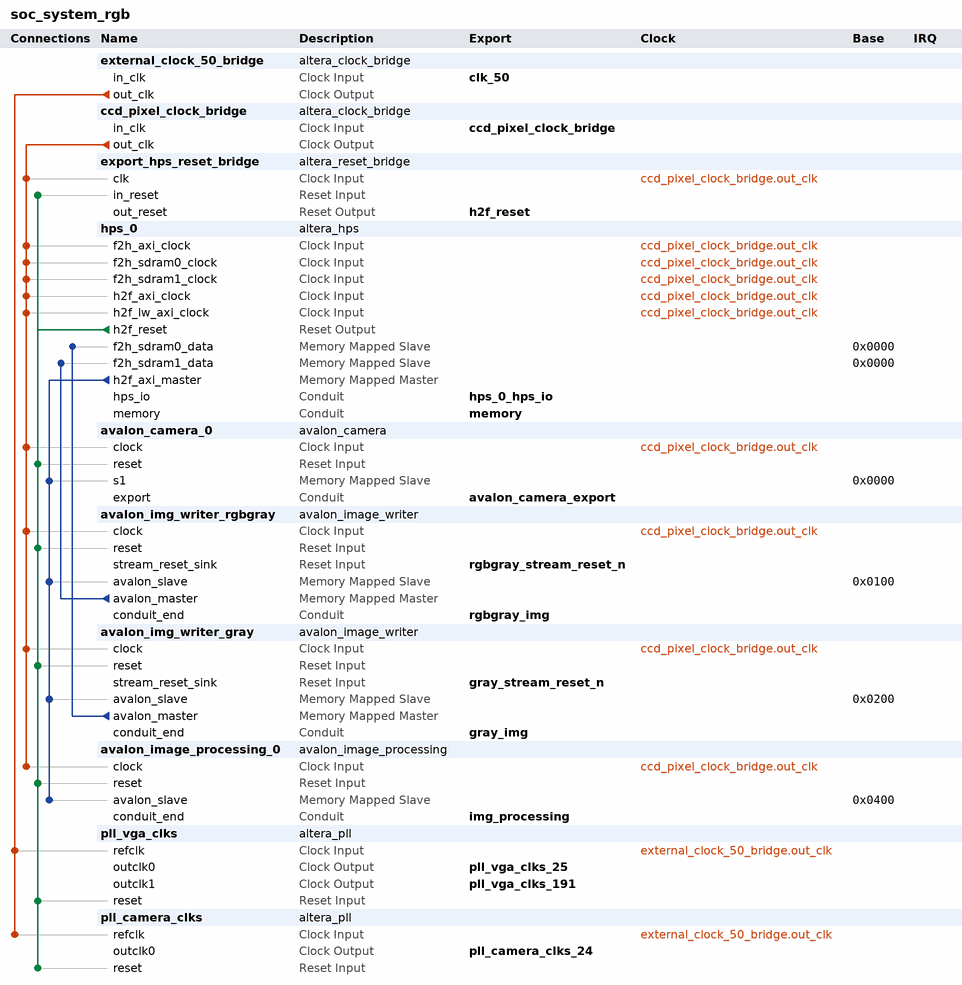
[diagram p0: system contents]
# Platform Designer (Qsys) system soc_system_rgb, Cyclone V 5CSEMA5F31C6
# Parameters at their usual value, and those the tool derives, are not listed.
package require -exact qsys 18.1
create_system soc_system_rgb
set_project_property DEVICE_FAMILY {Cyclone V}
set_project_property DEVICE 5CSEMA5F31C6

add_instance external_clock_50_bridge altera_clock_bridge 18.1
set_instance_parameter_value external_clock_50_bridge DERIVED_CLOCK_RATE 0
set_instance_parameter_value external_clock_50_bridge EXPLICIT_CLOCK_RATE 50000000

add_instance ccd_pixel_clock_bridge altera_clock_bridge 18.1
set_instance_parameter_value ccd_pixel_clock_bridge DERIVED_CLOCK_RATE 0
set_instance_parameter_value ccd_pixel_clock_bridge EXPLICIT_CLOCK_RATE 0

add_instance export_hps_reset_bridge altera_reset_bridge 18.1
set_instance_parameter_value export_hps_reset_bridge ACTIVE_LOW_RESET 1
set_instance_parameter_value export_hps_reset_bridge SYNCHRONOUS_EDGES deassert

add_instance hps_0 altera_hps 18.1
set_instance_parameter_value hps_0 EMAC1_Mode RGMII
set_instance_parameter_value hps_0 EMAC1_PinMuxing {HPS I/O Set 0}
set_instance_parameter_value hps_0 F2SCLK_COLDRST_Enable false
set_instance_parameter_value hps_0 F2SCLK_DBGRST_Enable false
set_instance_parameter_value hps_0 F2SCLK_WARMRST_Enable false
set_instance_parameter_value hps_0 F2SDRAM_Type {Avalon-MM Write-Only,Avalon-MM Write-Only}
set_instance_parameter_value hps_0 F2SDRAM_Width 128,128
set_instance_parameter_value hps_0 F2SINTERRUPT_Enable true
set_instance_parameter_value hps_0 F2S_Width 3
set_instance_parameter_value hps_0 FPGA_PERIPHERAL_OUTPUT_CLOCK_FREQ_EMAC0_GTX_CLK 100
set_instance_parameter_value hps_0 FPGA_PERIPHERAL_OUTPUT_CLOCK_FREQ_EMAC0_MD_CLK 100.0
set_instance_parameter_value hps_0 FPGA_PERIPHERAL_OUTPUT_CLOCK_FREQ_EMAC1_GTX_CLK 100
set_instance_parameter_value hps_0 FPGA_PERIPHERAL_OUTPUT_CLOCK_FREQ_EMAC1_MD_CLK 100.0
set_instance_parameter_value hps_0 HPS_PROTOCOL DDR3
set_instance_parameter_value hps_0 I2C0_Mode I2C
set_instance_parameter_value hps_0 I2C0_PinMuxing {HPS I/O Set 0}
set_instance_parameter_value hps_0 I2C1_Mode N/A
set_instance_parameter_value hps_0 I2C1_PinMuxing Unused
set_instance_parameter_value hps_0 LWH2F_Enable true
set_instance_parameter_value hps_0 MEM_BANKADDR_WIDTH 3
set_instance_parameter_value hps_0 MEM_CLK_FREQ 400.0
set_instance_parameter_value hps_0 MEM_COL_ADDR_WIDTH 10
set_instance_parameter_value hps_0 MEM_DQ_WIDTH 32
set_instance_parameter_value hps_0 MEM_DRV_STR RZQ/7
set_instance_parameter_value hps_0 MEM_ROW_ADDR_WIDTH 15
set_instance_parameter_value hps_0 MEM_RTT_NOM RZQ/4
set_instance_parameter_value hps_0 MEM_RTT_WR RZQ/4
set_instance_parameter_value hps_0 MEM_TCL 11
set_instance_parameter_value hps_0 MEM_TFAW_NS 30.0
set_instance_parameter_value hps_0 MEM_TRAS_NS 35.0
set_instance_parameter_value hps_0 MEM_TRCD_NS 13.75
set_instance_parameter_value hps_0 MEM_TRFC_NS 260.0
set_instance_parameter_value hps_0 MEM_TRP_NS 13.75
set_instance_parameter_value hps_0 MEM_VENDOR Micron
set_instance_parameter_value hps_0 MEM_WTCL 8
set_instance_parameter_value hps_0 QSPI_Mode N/A
set_instance_parameter_value hps_0 QSPI_PinMuxing Unused
set_instance_parameter_value hps_0 REF_CLK_FREQ 25.0
set_instance_parameter_value hps_0 S2FCLK_USER2CLK 5
set_instance_parameter_value hps_0 S2F_Width 3
set_instance_parameter_value hps_0 SDIO_Mode {4-bit Data}
set_instance_parameter_value hps_0 SDIO_PinMuxing {HPS I/O Set 0}
set_instance_parameter_value hps_0 SPIM1_Mode N/A
set_instance_parameter_value hps_0 SPIM1_PinMuxing Unused
set_instance_parameter_value hps_0 STM_Enable false
set_instance_parameter_value hps_0 TIMING_BOARD_AC_SKEW 0.02
set_instance_parameter_value hps_0 TIMING_BOARD_AC_TO_CK_SKEW 0.01
set_instance_parameter_value hps_0 TIMING_BOARD_DQ_TO_DQS_SKEW 0.05
set_instance_parameter_value hps_0 TIMING_BOARD_MAX_CK_DELAY 0.03
set_instance_parameter_value hps_0 TIMING_BOARD_MAX_DQS_DELAY 0.02
set_instance_parameter_value hps_0 TIMING_BOARD_SKEW_BETWEEN_DQS 0.06
set_instance_parameter_value hps_0 TIMING_BOARD_SKEW_CKDQS_DIMM_MAX 0.12
set_instance_parameter_value hps_0 TIMING_BOARD_SKEW_CKDQS_DIMM_MIN 0.06
set_instance_parameter_value hps_0 TIMING_BOARD_SKEW_WITHIN_DQS 0.01
set_instance_parameter_value hps_0 TIMING_TDH 65
set_instance_parameter_value hps_0 TIMING_TDQSCK 255
set_instance_parameter_value hps_0 TIMING_TDQSQ 125
set_instance_parameter_value hps_0 TIMING_TDS 30
set_instance_parameter_value hps_0 TIMING_TIH 140
set_instance_parameter_value hps_0 TIMING_TIS 180
set_instance_parameter_value hps_0 TIMING_TQSH 0.4
set_instance_parameter_value hps_0 UART0_Mode {No Flow Control}
set_instance_parameter_value hps_0 UART0_PinMuxing {HPS I/O Set 0}
set_instance_parameter_value hps_0 USB1_Mode SDR
set_instance_parameter_value hps_0 USB1_PinMuxing {HPS I/O Set 0}
set_instance_parameter_value hps_0 desired_cfg_clk_mhz 100.0
set_instance_parameter_value hps_0 desired_qspi_clk_mhz 400.0

add_instance avalon_camera_0 avalon_camera 1.0
set_instance_parameter_value avalon_camera_0 BLUE_GAIN 154
set_instance_parameter_value avalon_camera_0 COLUMN_MODE 3
set_instance_parameter_value avalon_camera_0 COLUMN_SIZE 2559
set_instance_parameter_value avalon_camera_0 EXPOSURE 1023
set_instance_parameter_value avalon_camera_0 GREEN1_GAIN 19
set_instance_parameter_value avalon_camera_0 GREEN2_GAIN 19
set_instance_parameter_value avalon_camera_0 HEIGHT 480
set_instance_parameter_value avalon_camera_0 H_BLANKING 0
set_instance_parameter_value avalon_camera_0 RED_GAIN 156
set_instance_parameter_value avalon_camera_0 ROW_MODE 3
set_instance_parameter_value avalon_camera_0 ROW_SIZE 1919
set_instance_parameter_value avalon_camera_0 START_COLUMN 0
set_instance_parameter_value avalon_camera_0 START_ROW 0
set_instance_parameter_value avalon_camera_0 V_BLANKING 25
set_instance_parameter_value avalon_camera_0 WIDTH 640

add_instance avalon_img_writer_rgbgray avalon_image_writer 1.0
set_instance_parameter_value avalon_img_writer_rgbgray COMPONENT_SIZE 8
set_instance_parameter_value avalon_img_writer_rgbgray NUMBER_COMPONENTS 4
set_instance_parameter_value avalon_img_writer_rgbgray PIX_WR 4

add_instance avalon_img_writer_gray avalon_image_writer 1.0
set_instance_parameter_value avalon_img_writer_gray COMPONENT_SIZE 8
set_instance_parameter_value avalon_img_writer_gray NUMBER_COMPONENTS 1
set_instance_parameter_value avalon_img_writer_gray PIX_WR 16

add_instance avalon_image_processing_0 avalon_image_processing 1.0
set_instance_parameter_value avalon_image_processing_0 BRIGHTNESS_THRESHOLD_H 255
set_instance_parameter_value avalon_image_processing_0 BRIGHTNESS_THRESHOLD_L 45
set_instance_parameter_value avalon_image_processing_0 HUE_THRESHOLD_H 20
set_instance_parameter_value avalon_image_processing_0 HUE_THRESHOLD_L 230
set_instance_parameter_value avalon_image_processing_0 SATURATION_THRESHOLD_H 255
set_instance_parameter_value avalon_image_processing_0 SATURATION_THRESHOLD_L 20

add_instance pll_vga_clks altera_pll 18.1
set_instance_parameter_value pll_vga_clks gui_device_speed_grade 2
set_instance_parameter_value pll_vga_clks gui_number_of_clocks 2
set_instance_parameter_value pll_vga_clks gui_operation_mode direct
set_instance_parameter_value pll_vga_clks gui_output_clock_frequency0 25.175
set_instance_parameter_value pll_vga_clks gui_output_clock_frequency1 191.0
set_instance_parameter_value pll_vga_clks gui_pll_mode {Integer-N PLL}
set_instance_parameter_value pll_vga_clks gui_reference_clock_frequency 50.0
set_instance_parameter_value pll_vga_clks gui_use_locked false

add_instance pll_camera_clks altera_pll 18.1
set_instance_parameter_value pll_camera_clks gui_device_speed_grade 2
set_instance_parameter_value pll_camera_clks gui_number_of_clocks 1
set_instance_parameter_value pll_camera_clks gui_operation_mode direct
set_instance_parameter_value pll_camera_clks gui_output_clock_frequency0 24.0
set_instance_parameter_value pll_camera_clks gui_pll_mode {Integer-N PLL}
set_instance_parameter_value pll_camera_clks gui_reference_clock_frequency 50.0
set_instance_parameter_value pll_camera_clks gui_use_locked false

# connections
add_connection ccd_pixel_clock_bridge.out_clk avalon_camera_0.clock clock
add_connection ccd_pixel_clock_bridge.out_clk avalon_image_processing_0.clock clock
add_connection ccd_pixel_clock_bridge.out_clk avalon_img_writer_gray.clock clock
add_connection ccd_pixel_clock_bridge.out_clk avalon_img_writer_rgbgray.clock clock
add_connection ccd_pixel_clock_bridge.out_clk export_hps_reset_bridge.clk clock
add_connection ccd_pixel_clock_bridge.out_clk hps_0.f2h_axi_clock clock
add_connection ccd_pixel_clock_bridge.out_clk hps_0.f2h_sdram0_clock clock
add_connection ccd_pixel_clock_bridge.out_clk hps_0.f2h_sdram1_clock clock
add_connection ccd_pixel_clock_bridge.out_clk hps_0.h2f_axi_clock clock
add_connection ccd_pixel_clock_bridge.out_clk hps_0.h2f_lw_axi_clock clock
add_connection external_clock_50_bridge.out_clk pll_camera_clks.refclk clock
add_connection external_clock_50_bridge.out_clk pll_vga_clks.refclk clock
add_connection hps_0.h2f_reset avalon_camera_0.reset reset
add_connection hps_0.h2f_reset avalon_image_processing_0.reset reset
add_connection hps_0.h2f_reset avalon_img_writer_gray.reset reset
add_connection hps_0.h2f_reset avalon_img_writer_rgbgray.reset reset
add_connection hps_0.h2f_reset export_hps_reset_bridge.in_reset reset
add_connection hps_0.h2f_reset pll_camera_clks.reset reset
add_connection hps_0.h2f_reset pll_vga_clks.reset reset
add_connection avalon_img_writer_gray.avalon_master hps_0.f2h_sdram0_data avalon
set_connection_parameter_value avalon_img_writer_gray.avalon_master/hps_0.f2h_sdram0_data baseAddress 0x0000
add_connection avalon_img_writer_rgbgray.avalon_master hps_0.f2h_sdram1_data avalon
set_connection_parameter_value avalon_img_writer_rgbgray.avalon_master/hps_0.f2h_sdram1_data baseAddress 0x0000
add_connection hps_0.h2f_axi_master avalon_camera_0.s1 avalon
set_connection_parameter_value hps_0.h2f_axi_master/avalon_camera_0.s1 baseAddress 0x0000
add_connection hps_0.h2f_axi_master avalon_image_processing_0.avalon_slave avalon
set_connection_parameter_value hps_0.h2f_axi_master/avalon_image_processing_0.avalon_slave baseAddress 0x0400
add_connection hps_0.h2f_axi_master avalon_img_writer_gray.avalon_slave avalon
set_connection_parameter_value hps_0.h2f_axi_master/avalon_img_writer_gray.avalon_slave baseAddress 0x0200
add_connection hps_0.h2f_axi_master avalon_img_writer_rgbgray.avalon_slave avalon
set_connection_parameter_value hps_0.h2f_axi_master/avalon_img_writer_rgbgray.avalon_slave baseAddress 0x0100

# exported interfaces
add_interface avalon_camera_export conduit end
set_interface_property avalon_camera_export EXPORT_OF avalon_camera_0.export
add_interface ccd_pixel_clock_bridge clock sink
set_interface_property ccd_pixel_clock_bridge EXPORT_OF ccd_pixel_clock_bridge.in_clk
add_interface clk_50 clock sink
set_interface_property clk_50 EXPORT_OF external_clock_50_bridge.in_clk
add_interface gray_img conduit end
set_interface_property gray_img EXPORT_OF avalon_img_writer_gray.conduit_end
add_interface gray_stream_reset_n reset sink
set_interface_property gray_stream_reset_n EXPORT_OF avalon_img_writer_gray.stream_reset_sink
add_interface h2f_reset reset source
set_interface_property h2f_reset EXPORT_OF export_hps_reset_bridge.out_reset
add_interface hps_0_hps_io conduit end
set_interface_property hps_0_hps_io EXPORT_OF hps_0.hps_io
add_interface img_processing conduit end
set_interface_property img_processing EXPORT_OF avalon_image_processing_0.conduit_end
add_interface memory conduit end
set_interface_property memory EXPORT_OF hps_0.memory
add_interface pll_camera_clks_24 clock source
set_interface_property pll_camera_clks_24 EXPORT_OF pll_camera_clks.outclk0
add_interface pll_vga_clks_191 clock source
set_interface_property pll_vga_clks_191 EXPORT_OF pll_vga_clks.outclk1
add_interface pll_vga_clks_25 clock source
set_interface_property pll_vga_clks_25 EXPORT_OF pll_vga_clks.outclk0
add_interface rgbgray_img conduit end
set_interface_property rgbgray_img EXPORT_OF avalon_img_writer_rgbgray.conduit_end
add_interface rgbgray_stream_reset_n reset sink
set_interface_property rgbgray_stream_reset_n EXPORT_OF avalon_img_writer_rgbgray.stream_reset_sink

set_interconnect_requirement {$system} qsys_mm.clockCrossingAdapter HANDSHAKE
set_interconnect_requirement {$system} qsys_mm.maxAdditionalLatency 1

save_system soc_system_rgb.qsys
